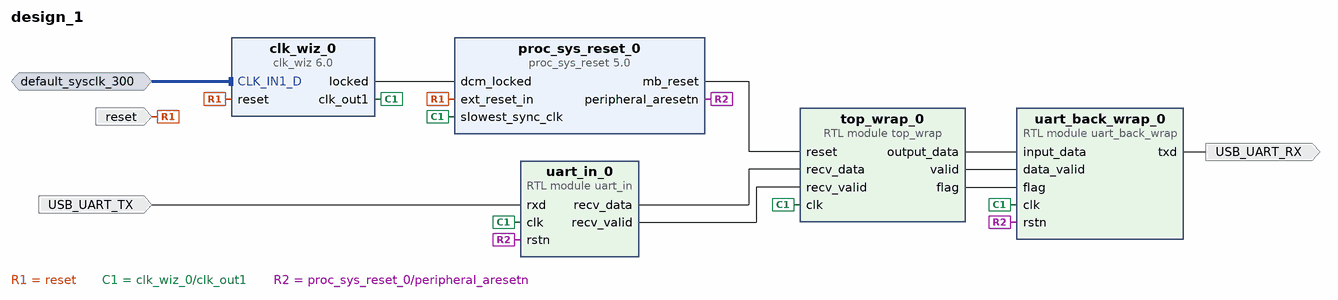
[diagram p0: block diagram of the top level]
# Vivado block design design_1, xcku040-ffva1156-2-e, Vivado 2019.2
create_bd_design design_1

create_bd_intf_port -mode Slave -vlnv xilinx.com:interface:diff_clock_rtl:1.0 default_sysclk_300
set_property -dict {CONFIG.FREQ_HZ 300000000} [get_bd_intf_ports default_sysclk_300]
create_bd_port -dir I -type rst reset
set_property -dict {CONFIG.POLARITY ACTIVE_HIGH} [get_bd_ports reset]
create_bd_port -dir I -type data USB_UART_TX
create_bd_port -dir O -type data USB_UART_RX

create_bd_cell -type module -reference top_wrap top_wrap_0
create_bd_cell -type ip -vlnv xilinx.com:ip:clk_wiz:6.0 clk_wiz_0
set_property -dict [list \
  CONFIG.CLKOUT1_JITTER 134.439 \
  CONFIG.CLKOUT1_PHASE_ERROR 118.362 \
  CONFIG.CLKOUT1_REQUESTED_OUT_FREQ 144.000 \
  CONFIG.CLK_IN1_BOARD_INTERFACE default_sysclk_300 \
  CONFIG.MMCM_CLKFBOUT_MULT_F 16.500 \
  CONFIG.MMCM_CLKOUT0_DIVIDE_F 6.875 \
  CONFIG.MMCM_DIVCLK_DIVIDE 5 \
  CONFIG.RESET_BOARD_INTERFACE reset \
  CONFIG.USE_BOARD_FLOW true \
] [get_bd_cells clk_wiz_0]
create_bd_cell -type module -reference uart_back_wrap uart_back_wrap_0
set_property -dict {CONFIG.CLK_PER_HALF_BIT 625} [get_bd_cells uart_back_wrap_0]
create_bd_cell -type ip -vlnv xilinx.com:ip:proc_sys_reset:5.0 proc_sys_reset_0
create_bd_cell -type module -reference uart_in uart_in_0
set_property -dict {CONFIG.CLK_PER_HALF_BIT 625} [get_bd_cells uart_in_0]

# ---- connections ----

connect_bd_intf_net -intf_net default_sysclk_300_1 [get_bd_intf_ports default_sysclk_300] [get_bd_intf_pins clk_wiz_0/CLK_IN1_D]
connect_bd_net [get_bd_ports reset] [get_bd_pins clk_wiz_0/reset] [get_bd_pins proc_sys_reset_0/ext_reset_in]
connect_bd_net [get_bd_pins clk_wiz_0/clk_out1] \
  [get_bd_pins top_wrap_0/clk] [get_bd_pins proc_sys_reset_0/slowest_sync_clk] [get_bd_pins uart_back_wrap_0/clk] \
  [get_bd_pins uart_in_0/clk]
connect_bd_net [get_bd_pins clk_wiz_0/locked] [get_bd_pins proc_sys_reset_0/dcm_locked]
connect_bd_net [get_bd_pins proc_sys_reset_0/mb_reset] [get_bd_pins top_wrap_0/reset]
connect_bd_net [get_bd_pins proc_sys_reset_0/peripheral_aresetn] [get_bd_pins uart_back_wrap_0/rstn] [get_bd_pins uart_in_0/rstn]
connect_bd_net [get_bd_pins top_wrap_0/output_data] [get_bd_pins uart_back_wrap_0/input_data]
connect_bd_net [get_bd_pins top_wrap_0/valid] [get_bd_pins uart_back_wrap_0/data_valid]
connect_bd_net [get_bd_pins top_wrap_0/flag] [get_bd_pins uart_back_wrap_0/flag]
connect_bd_net [get_bd_pins uart_in_0/recv_data] [get_bd_pins top_wrap_0/recv_data]
connect_bd_net [get_bd_pins uart_in_0/recv_valid] [get_bd_pins top_wrap_0/recv_valid]
connect_bd_net [get_bd_ports USB_UART_TX] [get_bd_pins uart_in_0/rxd]
connect_bd_net [get_bd_pins uart_back_wrap_0/txd] [get_bd_ports USB_UART_RX]

validate_bd_design
save_bd_design
